# Altium schematic sheet soldier_top.SchDoc
size Tabloid; SheetNumber: 1; SheetTotal: 6
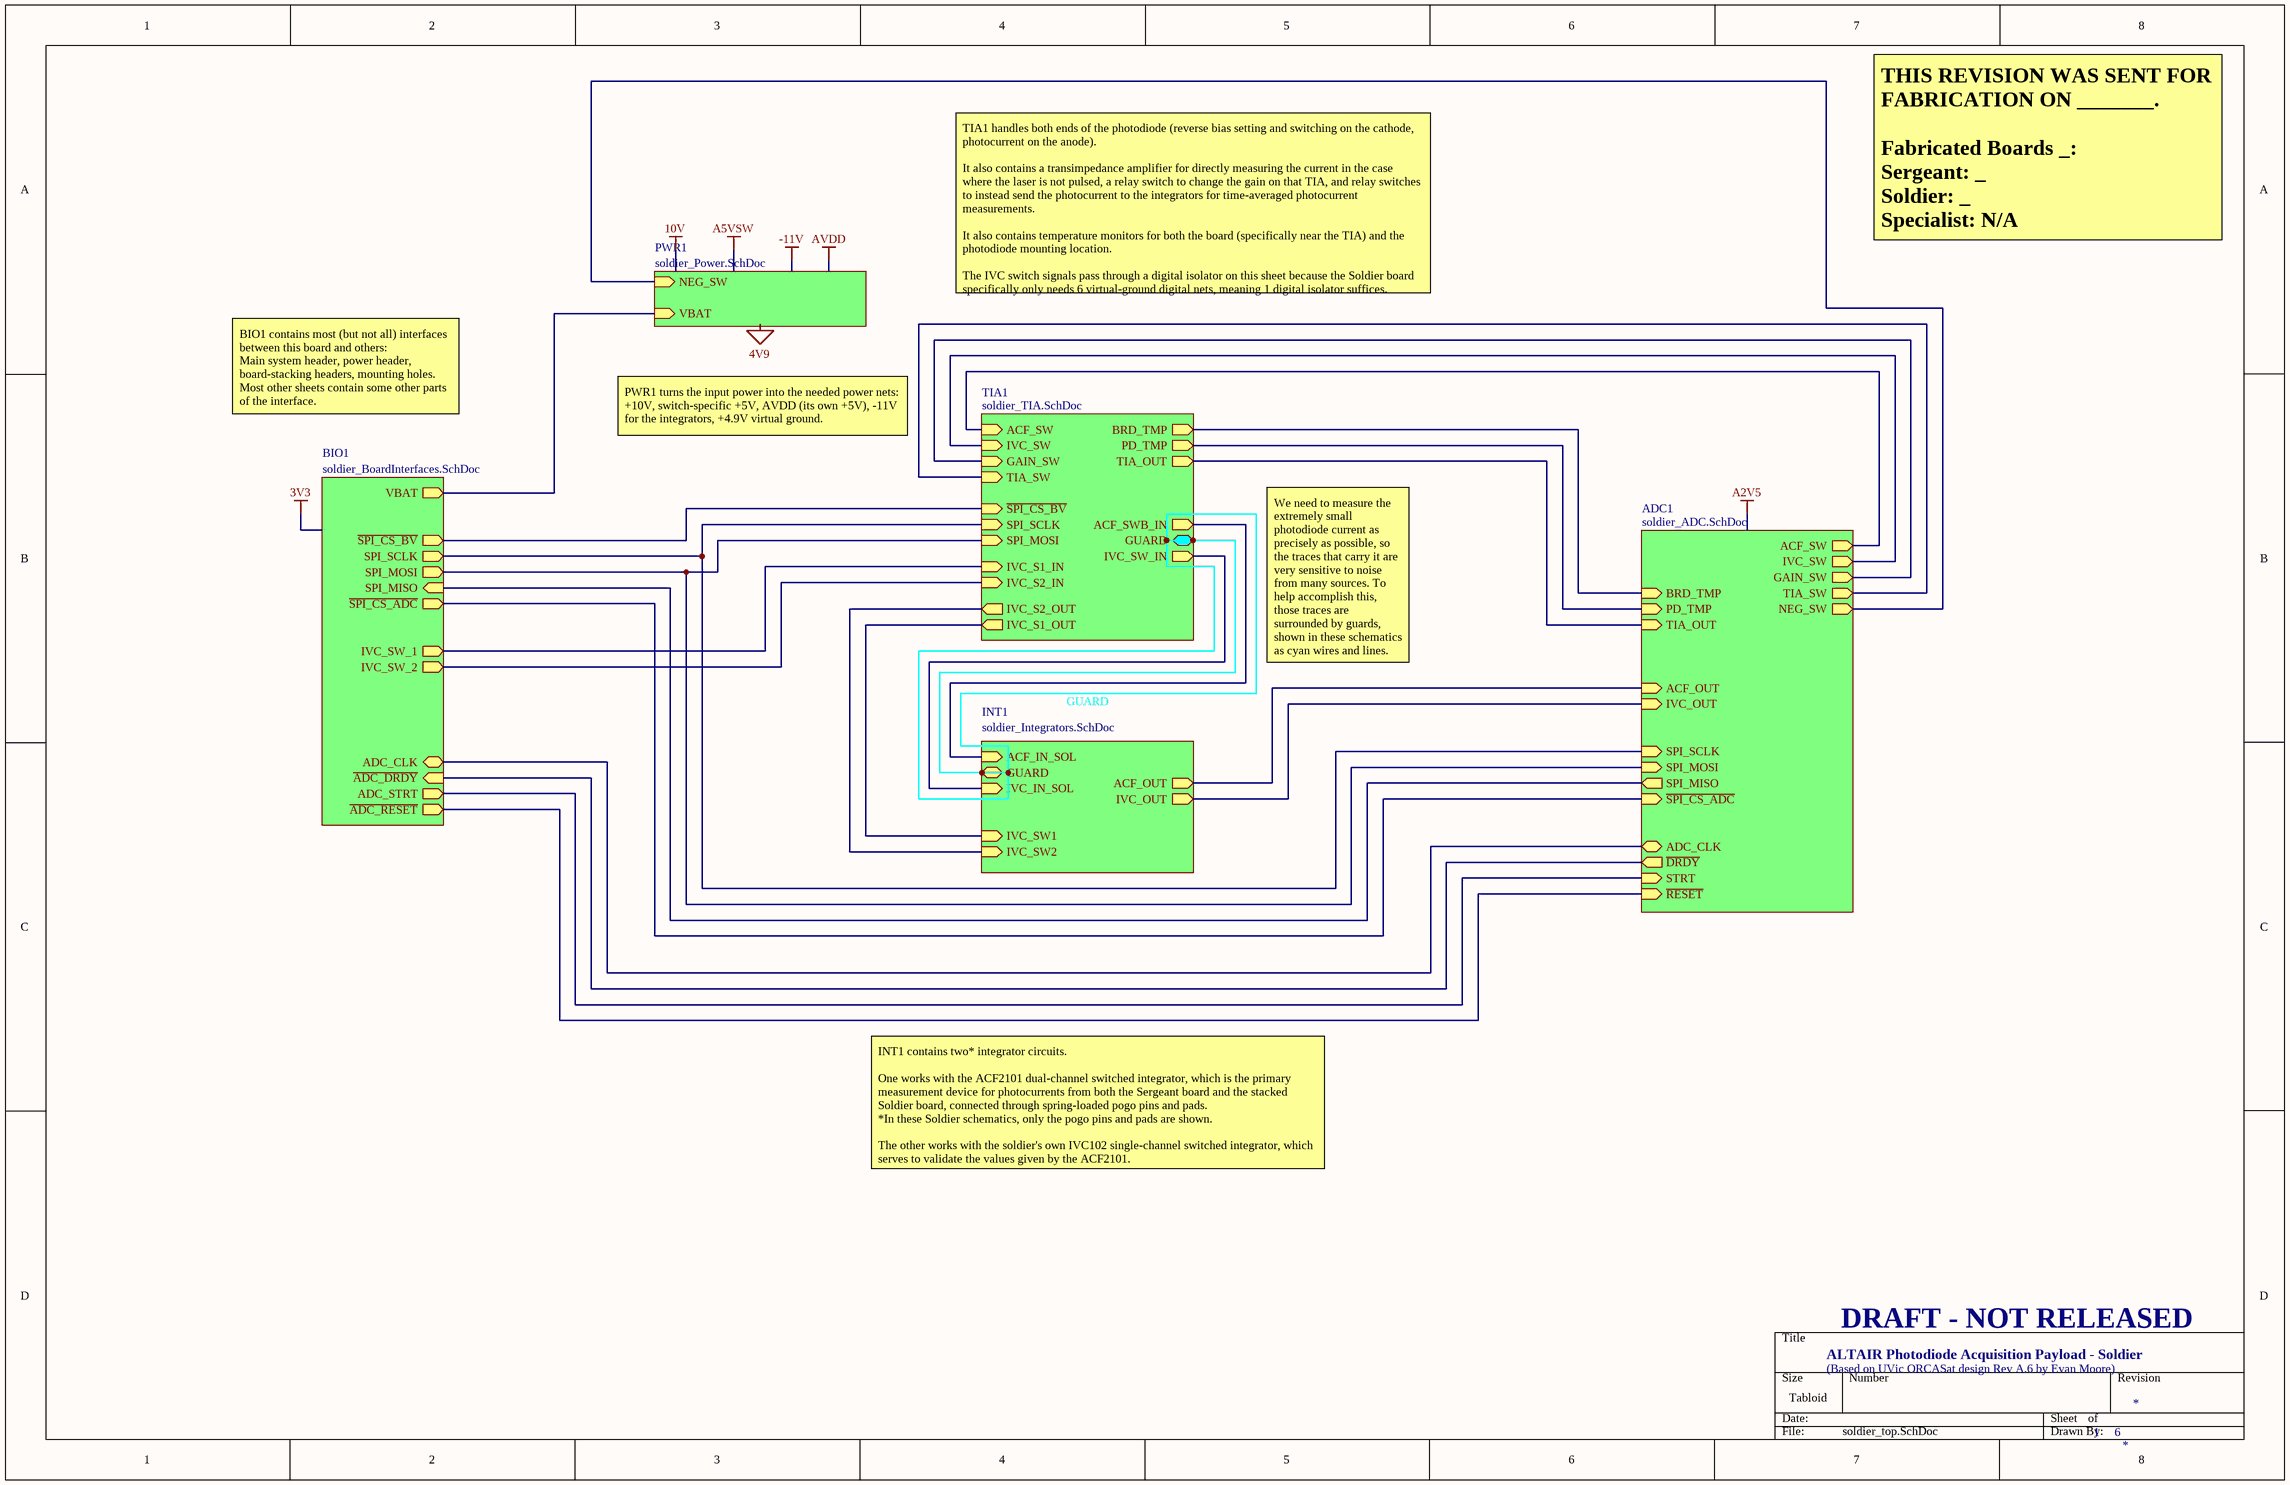
[diagram p0: soldier_top.SchDoc]

## Sub-sheets
ADC1 = soldier_ADC.SchDoc: BRD_TMP (in), PD_TMP (in), TIA_OUT (in), ACF_OUT (in), IVC_OUT (in), SPI_SCLK (in), SPI_MOSI (in), SPI_MISO (out), ~{SPI_CS_ADC} (in), ADC_CLK (bidir), ~{DRDY} (out), STRT (in), ~{RESET} (in), ACF_SW (out), IVC_SW (out), GAIN_SW (out), TIA_SW (out), NEG_SW (out)
BIO1 = soldier_BoardInterfaces.SchDoc: VBAT (out), ~{SPI_CS_BV} (out), SPI_SCLK (out), SPI_MOSI (out), SPI_MISO (in), ~{SPI_CS_ADC} (out), IVC_SW_1 (out), IVC_SW_2 (out), ADC_CLK (bidir), ~{ADC_RESET} (out), ~{ADC_DRDY} (in), ADC_STRT (out)
INT1 = soldier_Integrators.SchDoc: ACF_IN_SOL (in), GUARD (bidir), IVC_IN_SOL (in), IVC_SW1 (in), IVC_SW2 (in), IVC_OUT (out), ACF_OUT (out)
PWR1 = soldier_Power.SchDoc: NEG_SW (in), VBAT (in)
TIA1 = soldier_TIA.SchDoc: SPI_MOSI (in), SPI_SCLK (in), ~{SPI_CS_BV} (in), ACF_SW (in), IVC_SW (in), BRD_TMP (out), PD_TMP (out), TIA_OUT (out), IVC_SW_IN (out), GUARD (bidir), ACF_SWB_IN (out), GAIN_SW (in), TIA_SW (in), IVC_S1_IN (in), IVC_S2_IN (in), IVC_S1_OUT (out), IVC_S2_OUT (out)

## Nets
(unnamed): sheet BIO1/VBAT, sheet PWR1/VBAT
(unnamed): sheet BIO1/~{SPI_CS_BV}, sheet TIA1/~{SPI_CS_BV}
(unnamed): sheet BIO1/SPI_SCLK, sheet TIA1/SPI_SCLK, sheet ADC1/SPI_SCLK
(unnamed): sheet BIO1/SPI_MOSI, sheet TIA1/SPI_MOSI, sheet ADC1/SPI_MOSI
(unnamed): sheet BIO1/SPI_MISO, sheet ADC1/SPI_MISO
(unnamed): sheet BIO1/~{SPI_CS_ADC}, sheet ADC1/~{SPI_CS_ADC}
(unnamed): sheet BIO1/IVC_SW_1, sheet TIA1/IVC_S1_IN
(unnamed): sheet BIO1/IVC_SW_2, sheet TIA1/IVC_S2_IN
(unnamed): sheet BIO1/ADC_CLK, sheet ADC1/ADC_CLK
(unnamed): sheet BIO1/~{ADC_RESET}, sheet ADC1/~{RESET}
(unnamed): sheet BIO1/~{ADC_DRDY}, sheet ADC1/~{DRDY}
(unnamed): sheet BIO1/ADC_STRT, sheet ADC1/STRT
(unnamed): sheet PWR1/NEG_SW, sheet ADC1/NEG_SW
(unnamed): sheet TIA1/ACF_SW, sheet ADC1/ACF_SW
(unnamed): sheet TIA1/IVC_SW, sheet ADC1/IVC_SW
(unnamed): sheet TIA1/BRD_TMP, sheet ADC1/BRD_TMP
(unnamed): sheet TIA1/PD_TMP, sheet ADC1/PD_TMP
(unnamed): sheet TIA1/TIA_OUT, sheet ADC1/TIA_OUT
(unnamed): sheet TIA1/IVC_SW_IN, sheet INT1/IVC_IN_SOL
(unnamed): sheet TIA1/GUARD, sheet INT1/GUARD
(unnamed): sheet TIA1/ACF_SWB_IN, sheet INT1/ACF_IN_SOL
(unnamed): sheet TIA1/GAIN_SW, sheet ADC1/GAIN_SW
(unnamed): sheet TIA1/TIA_SW, sheet ADC1/TIA_SW
(unnamed): sheet TIA1/IVC_S1_OUT, sheet INT1/IVC_SW1
(unnamed): sheet TIA1/IVC_S2_OUT, sheet INT1/IVC_SW2
(unnamed): sheet INT1/IVC_OUT, sheet ADC1/IVC_OUT
(unnamed): sheet INT1/ACF_OUT, sheet ADC1/ACF_OUT

## Notes on the sheet
- THIS REVISION WAS SENT FOR FABRICATION ON _______.
  Fabricated Boards _:
  Sergeant: _
  Soldier: _
  Specialist: N/A
- TIA1 handles both ends of the photodiode (reverse bias setting and switching on the cathode, photocurrent on the anode).
  It also contains a transimpedance amplifier for directly measuring the current in the case where the laser is not pulsed, a relay switch to change the gain on that TIA, and relay switches to instead send the photocurrent to the integrators for time-averaged photocurrent measurements.
  It also contains temperature monitors for both the board (specifically near the TIA) and the photodiode mounting location.
  The IVC switch signals pass through a digital isolator on this sheet because the Soldier board specifically only needs 6 virtual-ground digital nets, meaning 1 digital isolator suffices.
- BIO1 contains most (but not all) interfaces between this board and others:
  Main system header, power header, board-stacking headers, mounting holes.
  Most other sheets contain some other parts of the interface.
- PWR1 turns the input power into the needed power nets:
  +10V, switch-specific +5V, AVDD (its own +5V), -11V for the integrators, +4.9V virtual ground.
- We need to measure the extremely small photodiode current as precisely as possible, so the traces that carry it are very sensitive to noise from many sources. To help accomplish this, those traces are surrounded by guards, shown in these schematics as cyan wires and lines.
- GUARD
- INT1 contains two* integrator circuits.
  One works with the ACF2101 dual-channel switched integrator, which is the primary measurement device for photocurrents from both the Sergeant board and the stacked Soldier board, connected through spring-loaded pogo pins and pads.
  *In these Soldier schematics, only the pogo pins and pads are shown.
  The other works with the soldier's own IVC102 single-channel switched integrator, which serves to validate the values given by the ACF2101.
- ALTAIR Photodiode Acquisition Payload - Soldier
- (Based on UVic ORCASat design Rev A.6 by Evan Moore)
- DRAFT - NOT RELEASED
- Labels drawn without touching a wire or pin: 4V9